# Altium schematic sheet Valvulas_Prueba.SchDoc
size A4
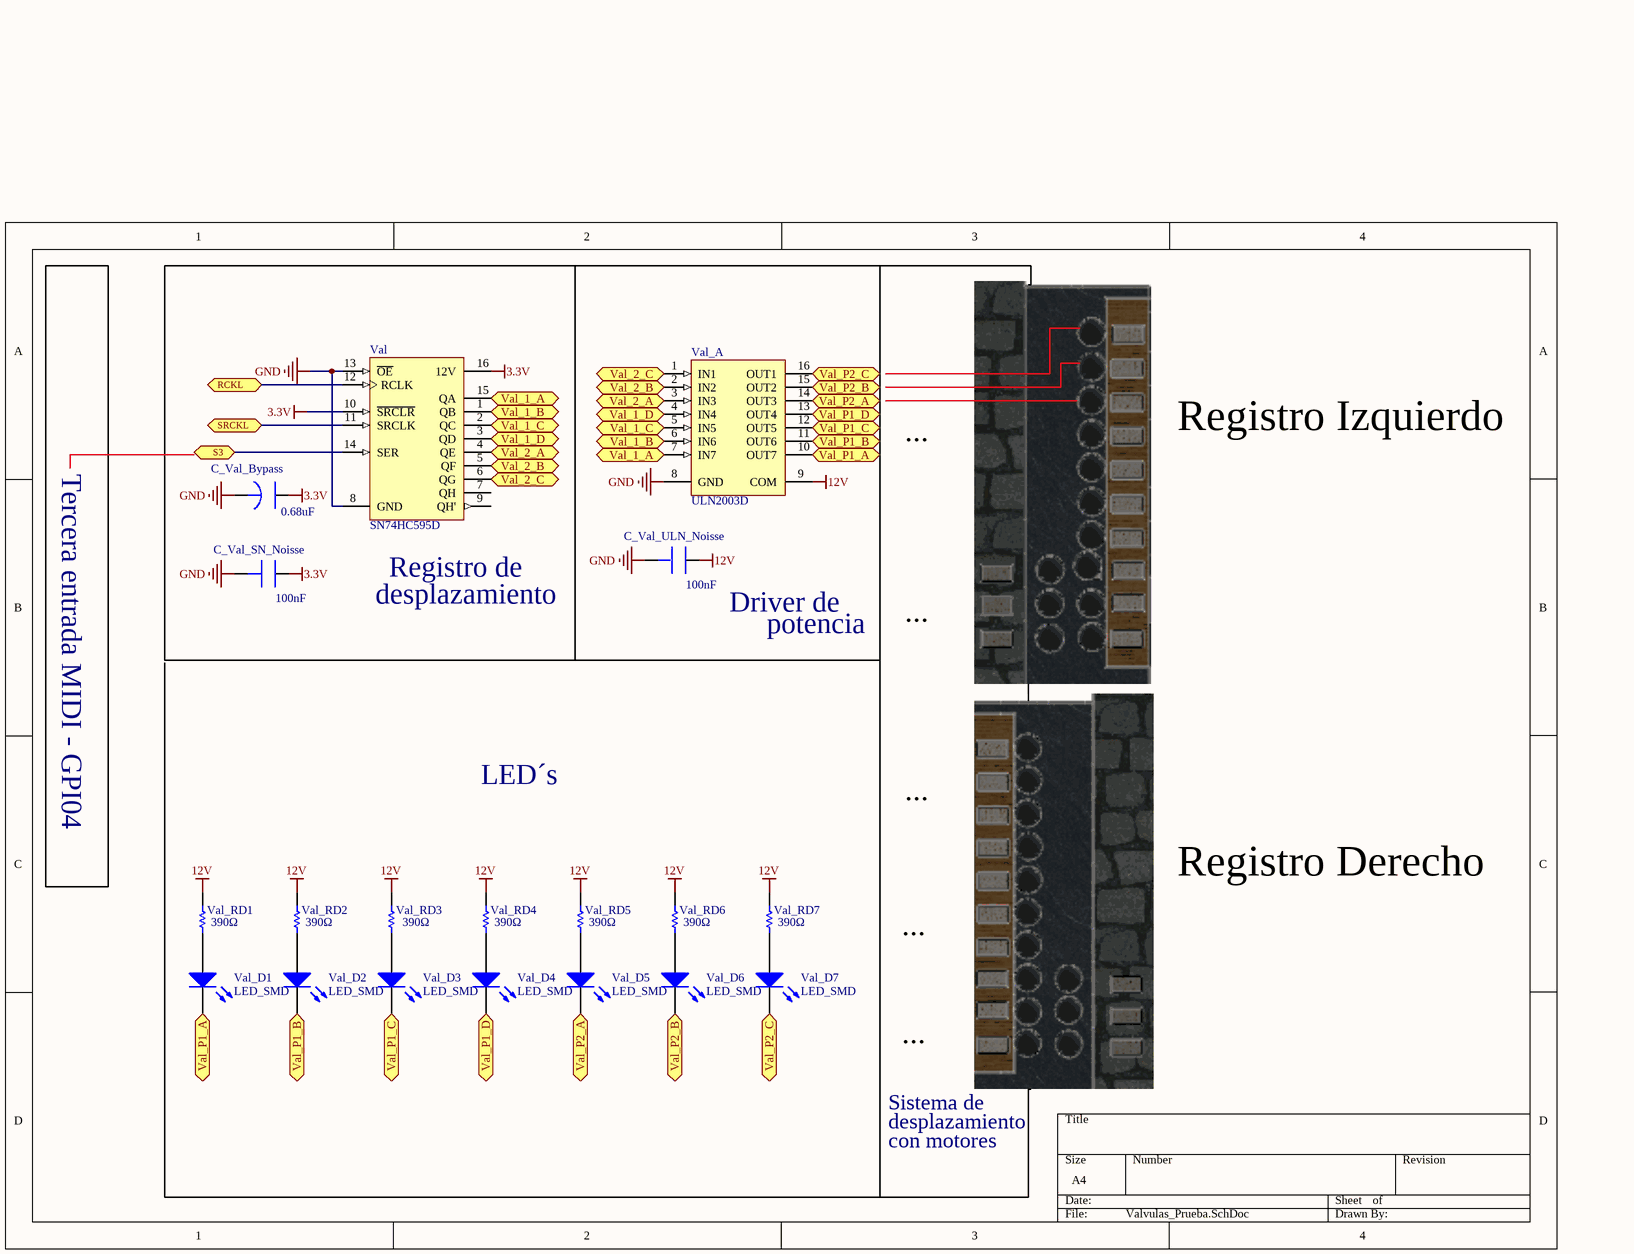
[diagram p0: Valvulas_Prueba.SchDoc]

## Parts
C_Val_Bypass  value 0.68uF  [Panasonic B Size]  (hidden comment: Panasonic 1uF)
C_Val_SN_Noisse  value 100nF  [AVX Carcasa 1.206]  (hidden comment: AVX 100nF)
C_Val_ULN_Noisse  value 100nF  [AVX Carcasa 1.206]  (hidden comment: AVX 100nF)
Val  SN74HC595D  [SN74HC595D]
Val_A  ULN2003D  [ULN2003AI]
Val_D1  LED_SMD  [LED_0805]
Val_D2  LED_SMD  [LED_0805]
Val_D3  LED_SMD  [LED_0805]
Val_D4  LED_SMD  [LED_0805]
Val_D5  LED_SMD  [LED_0805]
Val_D6  LED_SMD  [LED_0805]
Val_D7  LED_SMD  [LED_0805]
Val_RD1  value 390Ω  [Resistencia_0805_N]  (hidden comment: Res Chip 0805)
Val_RD2  value 390Ω  [Resistencia_0805_N]  (hidden comment: Res Chip 0805)
Val_RD3  value 390Ω  [Resistencia_0805_N]  (hidden comment: Res Chip 0805)
Val_RD4  value 390Ω  [Resistencia_0805_N]  (hidden comment: Res Chip 0805)
Val_RD5  value 390Ω  [Resistencia_0805_N]  (hidden comment: Res Chip 0805)
Val_RD6  value 390Ω  [Resistencia_0805_N]  (hidden comment: Res Chip 0805)
Val_RD7  value 390Ω  [Resistencia_0805_N]  (hidden comment: Res Chip 0805)

## Ports
RCKL, S3, SRCKL, Val_1_A, Val_1_B, Val_1_C, Val_1_D, Val_2_A, Val_2_B, Val_2_C, Val_P1_A, Val_P1_B, Val_P1_C, Val_P1_D, Val_P2_A, Val_P2_B, Val_P2_C

## Nets
3.3V: C_Val_Bypass.1 C_Val_SN_Noisse.1 Val.10(~{SRCLR}) Val.16(12V)
12V: C_Val_ULN_Noisse.1 Val_A.9(COM) Val_RD1.2 Val_RD2.2 Val_RD3.2 Val_RD4.2 Val_RD5.2 Val_RD6.2 Val_RD7.2
GND: C_Val_Bypass.2 C_Val_SN_Noisse.2 C_Val_ULN_Noisse.2 Val.8(GND) Val.13(~{OE}) Val_A.8(GND)
RCKL: Val.12(RCLK) ; port RCKL
S3: Val.14(SER) ; port S3
SRCKL: Val.11(SRCLK) ; port SRCKL
Val_1_A: Val.15(QA) Val_A.7(IN7) ; port Val_1_A
Val_1_B: Val.1(QB) Val_A.6(IN6) ; port Val_1_B
Val_1_C: Val.2(QC) Val_A.5(IN5) ; port Val_1_C
Val_1_D: Val.3(QD) Val_A.4(IN4) ; port Val_1_D
Val_2_A: Val.4(QE) Val_A.3(IN3) ; port Val_2_A
Val_2_B: Val.5(QF) Val_A.2(IN2) ; port Val_2_B
Val_2_C: Val.6(QG) Val_A.1(IN1) ; port Val_2_C
Val_P1_A: Val_A.10(OUT7) Val_D1.2(K) ; port Val_P1_A
Val_P1_B: Val_A.11(OUT6) Val_D2.2(K) ; port Val_P1_B
Val_P1_C: Val_A.12(OUT5) Val_D3.2(K) ; port Val_P1_C
Val_P1_D: Val_A.13(OUT4) Val_D4.2(K) ; port Val_P1_D
Val_P2_A: Val_A.14(OUT3) Val_D5.2(K) ; port Val_P2_A
Val_P2_B: Val_A.15(OUT2) Val_D6.2(K) ; port Val_P2_B
Val_P2_C: Val_A.16(OUT1) Val_D7.2(K) ; port Val_P2_C
NetVal_D1_1: Val_D1.1(A) Val_RD1.1
NetVal_D2_1: Val_D2.1(A) Val_RD2.1
NetVal_D3_1: Val_D3.1(A) Val_RD3.1
NetVal_D4_1: Val_D4.1(A) Val_RD4.1
NetVal_D5_1: Val_D5.1(A) Val_RD5.1
NetVal_D6_1: Val_D6.1(A) Val_RD6.1
NetVal_D7_1: Val_D7.1(A) Val_RD7.1

Not connected (* = marked no-connect by the designer): Val 7(QH) 9(QH')

## Notes on the sheet
- ...
- Registro Izquierdo
- Tercera entrada MIDI - GPI04
- (near Val) Registro de
- desplazamiento
- (near C_Val_ULN_Noisse) Driver de
- potencia
- LED´s
- Registro Derecho
- Sistema de
- con motores

## Library data of the parts
C_Val_Bypass = Panasonic 1uF: Condensador Electrolítico SMD; Manufacturer #1: Nippon Chemi-Con; Part Number: EMV-500ADA101MJA0G; Tolerance: 20%; Ref. Mafero: 230; Voltage Rating: 50V; PCB DECAL: Panasonic B; Author: Jaime Jiménez Ortega; Cost: 0,718€; Date: 21/05/2009; Distributor: RS; Ref Distributor: 5479063
C_Val_SN_Noisse C_Val_ULN_Noisse = AVX 100nF: Condensador Cerámico SMD; Manufacturer #1: Nippon Chemi-Con; Part Number: EMV-500ADA101MJA0G; Tolerance: 20%; Ref. Mafero: 230; Voltage Rating: 50V; Author: Jaime Jiménez Ortega; Cost: 0,718€; Date: 21/05/2009; Distributor: RS; Ref Distributor: 5479063; PCB DECAL: AVX 1206
Val = SN74HC595D: 8-Bit Shift Register with 3-State Output Registers; Published: 8-Jun-2000; LatestRevisionDate: 13-Apr-2006; LatestRevisionNote: IPC-7351 Footprint Added.; DatasheetVersion: May-1997; PackageVersion: Jan-1998; PackageReference: D016; Publisher: Altium Limited; PackageDescription: 16-Pin Small Outline Integrated Circuit 1.27 mm Pitch; Code_IPC: SOIC127P600-16; ComponentLink1Description: Manufacturer Link; ComponentLink1URL: http://www.ti.com/; ComponentLink2Description: Datasheet; ComponentLink2URL: http://www-s.ti.com/sc/ds/sn74hc595.pdf
Val_A = ULN2003D: Seven Darlington Array; Published: 8-Jun-2000; LatestRevisionDate: 13-Apr-2006; LatestRevisionNote: IPC-7351 Footprint Added.; DatasheetVersion: Sep-1998; PackageVersion: May-1998; PackageReference: SO16; Publisher: Altium Limited; PackageDescription: 16-Pin Small Outline Integrated Circuit 1.27 mm Pitch; Code_IPC: SOIC127P600-16; ComponentLink1Description: Manufacturer Link; ComponentLink1URL: http://www.st.com/; ComponentLink2Description: Datasheet; ComponentLink2URL: http://www.st.com/stonline/products/literature/ds/5279/uln2001.pdf
Val_D1-Val_D7 = LED_SMD: LED SMD; Published: 8-Jun-2000; LatestRevisionDate: 08-Jul-2005; LatestRevisionNote: Mech Layer 1 removed.; PackageReference: LED-0; Publisher: Altium Limited
Val_RD1-Val_RD7 = Resistencia: Published: 8-Jun-2000; LatestRevisionDate: 17-Jul-2002; LatestRevisionNote: Re-released for DXP Platform.; PackageReference: AXIAL-0.3; Publisher: Altium Limited; PackageDescription: Axial Device, Thru-Hole; 2 Leads; 0.3 in Pin Spacing